# Altium schematic sheet Connectors.SchDoc
size A4
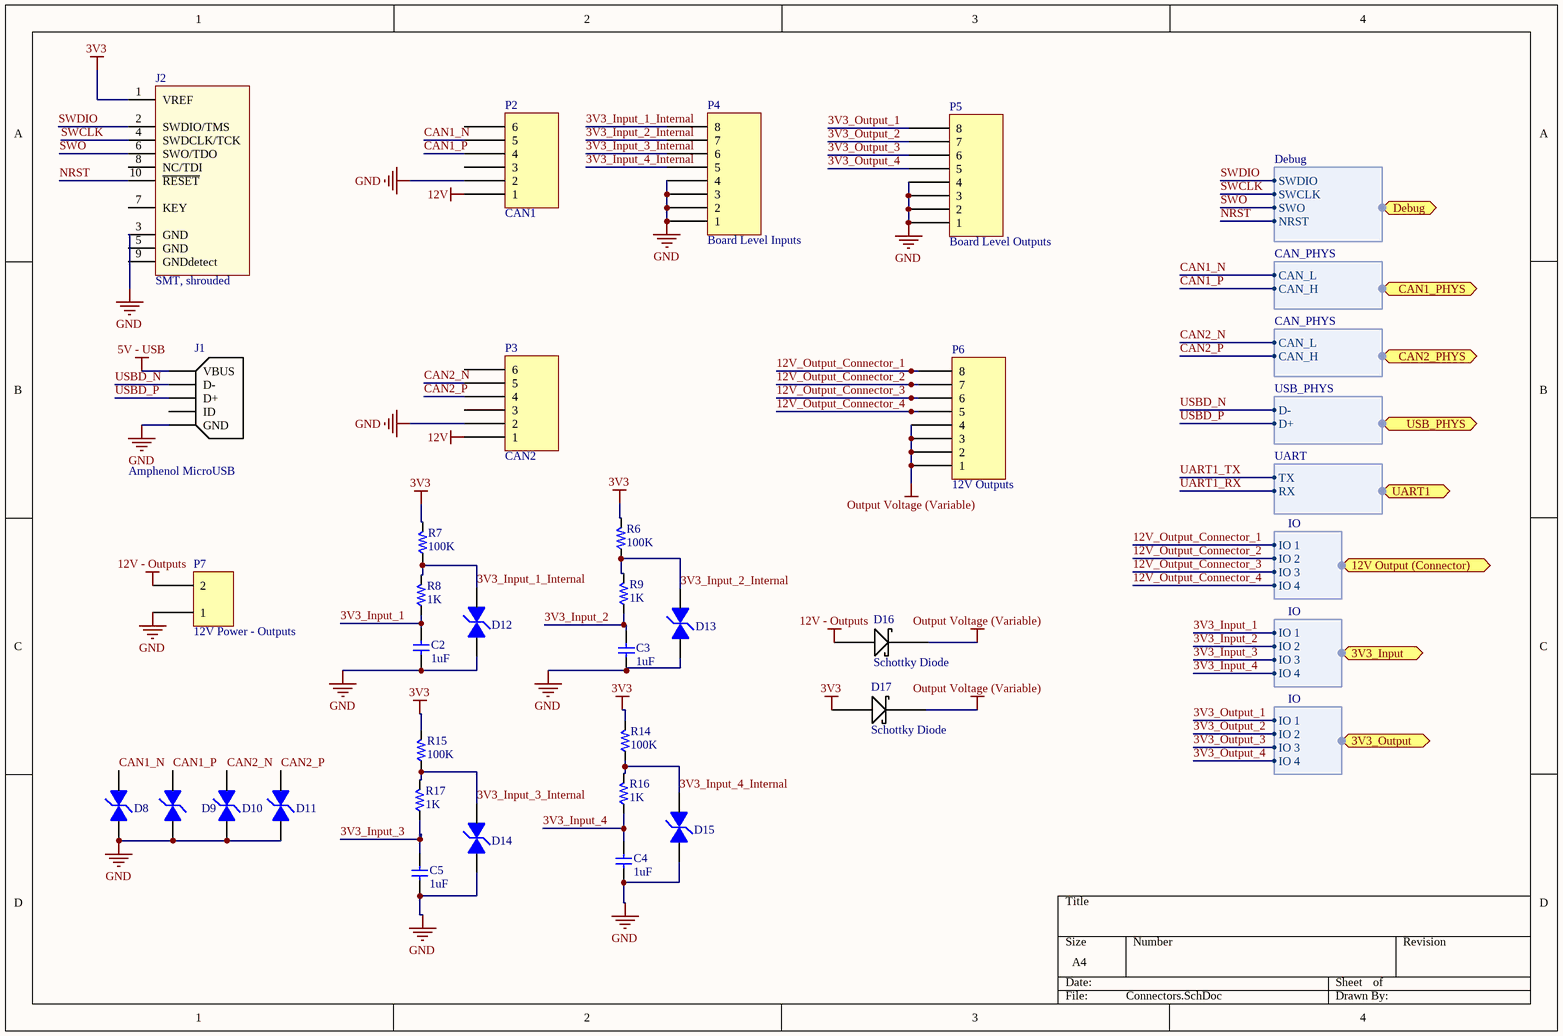
[diagram p0: Connectors.SchDoc]

## Parts
C2  value 1uF  [PCB_GENERIC_SMD_0603]  (hidden comment: C060-0001U-00)
C3  value 1uF  [PCB_GENERIC_SMD_0603]  (hidden comment: C060-0001U-00)
C4  value 1uF  [PCB_GENERIC_SMD_0603]  (hidden comment: C060-0001U-00)
C5  value 1uF  [PCB_GENERIC_SMD_0603]  (hidden comment: C060-0001U-00)
D8  TVS Diode  [TVS Diode]  (value not drawn)
D9  TVS Diode  [TVS Diode]  (value not drawn)
D10  TVS Diode  [TVS Diode]  (value not drawn)
D11  TVS Diode  [TVS Diode]  (value not drawn)
D12  TVS Diode  [TVS Diode]  (value not drawn)
D13  TVS Diode  [TVS Diode]  (value not drawn)
D14  TVS Diode  [TVS Diode]  (value not drawn)
D15  TVS Diode  [TVS Diode]  (value not drawn)
D16  Schottky Diode  [ON Semi Schottky Diode - MBRM110LT1G]
D17  Schottky Diode  [ON Semi Schottky Diode - MBRM110LT1G]
J1  Amphenol MicroUSB  [Amphenol MicroUSB]
J2  SMT, shrouded  [CONN-50mil-10POS-SMD]
P2  CAN1  [PCB_MLX_MICROFIT_3X2]
P3  CAN2  [PCB_MLX_MICROFIT_3X2]
P4  Board Level Inputs  [PCB_MLX_MICROFIT_4X2]
P5  Board Level Outputs  [PCB_MLX_MICROFIT_4X2]
P6  12V Outputs  [PCB_MLX_MICROFIT_4X2]
P7  12V Power - Outputs  [Molex Mini-Fit Jr 2x1]
R6  value 100K  [PCB_GENERIC_SMD_0603]  (hidden comment: R060-00104-05)
R7  value 100K  [PCB_GENERIC_SMD_0603]  (hidden comment: R060-00104-05)
R8  value 1K  [PCB_GENERIC_SMD_0603]  (hidden comment: R060-00102-05)
R9  value 1K  [PCB_GENERIC_SMD_0603]  (hidden comment: R060-00102-05)
R14  value 100K  [PCB_GENERIC_SMD_0603]  (hidden comment: R060-00104-05)
R15  value 100K  [PCB_GENERIC_SMD_0603]  (hidden comment: R060-00104-05)
R16  value 1K  [PCB_GENERIC_SMD_0603]  (hidden comment: R060-00102-05)
R17  value 1K  [PCB_GENERIC_SMD_0603]  (hidden comment: R060-00102-05)

## Ports
3V3_Input (harness IO), 3V3_Output (harness IO), 12V Output (Connector) (harness IO), CAN1_PHYS (harness CAN_PHYS), CAN2_PHYS (harness CAN_PHYS), Debug (harness Debug), UART1 (harness UART), USB_PHYS (harness USB_PHYS)

## Harnesses
Debug: SWDIO, SWCLK, SWO, NRST
CAN_PHYS: CAN_L, CAN_H
USB_PHYS: D-, D+
UART: TX, RX
IO: IO 1, IO 2, IO 3, IO 4

## Nets
3V3: D17.2 J2.1(VREF) R6.2 R7.2 R14.2 R15.2
5V - USB: J1.1(VBUS)
12V: P2.1 P3.1
12V - Outputs: D16.2 P7.2
GND: C2.1 C3.1 C4.1 C5.1 D8.2 D9.2 D10.2 D11.2 D12.2 D13.2 D14.2 D15.2 J1.5(GND) J2.3(GND) P2.2 P3.2 P4.1 P4.2 P4.3 P4.4 P5.1 P5.2 P5.3 P5.4 P7.1
Output Voltage (Variable): D16.1 D17.1 P6.1 P6.2 P6.3 P6.4
3V3_Input_1: C2.2 R8.1 ; port 3V3_Input.IO 1
3V3_Input_1_Internal: D12.1 P4.8 R7.1 R8.2
3V3_Input_2: C3.2 R9.1 ; port 3V3_Input.IO 2
3V3_Input_2_Internal: D13.1 P4.7 R6.1 R9.2
3V3_Input_3: C5.2 R17.1 ; port 3V3_Input.IO 3
3V3_Input_3_Internal: D14.1 P4.6 R15.1 R17.2
3V3_Input_4: C4.2 R16.1 ; port 3V3_Input.IO 4
3V3_Input_4_Internal: D15.1 P4.5 R14.1 R16.2
3V3_Output_1: P5.8 ; port 3V3_Output.IO 1
3V3_Output_2: P5.7 ; port 3V3_Output.IO 2
3V3_Output_3: P5.6 ; port 3V3_Output.IO 3
3V3_Output_4: P5.5 ; port 3V3_Output.IO 4
12V_Output_Connector_1: P6.8 ; port 12V Output (Connector).IO 1
12V_Output_Connector_2: P6.7 ; port 12V Output (Connector).IO 2
12V_Output_Connector_3: P6.6 ; port 12V Output (Connector).IO 3
12V_Output_Connector_4: P6.5 ; port 12V Output (Connector).IO 4
CAN1_N: D8.1 P2.5 ; port CAN1_PHYS.CAN_L
CAN1_P: D9.1 P2.4 ; port CAN1_PHYS.CAN_H
CAN2_N: D10.1 P3.5 ; port CAN2_PHYS.CAN_L
CAN2_P: D11.1 P3.4 ; port CAN2_PHYS.CAN_H
NRST: J2.10(~{RESET}) ; port Debug.NRST
SWCLK: J2.4(SWDCLK/TCK) ; port Debug.SWCLK
SWDIO: J2.2(SWDIO/TMS) ; port Debug.SWDIO
SWO: J2.6(SWO/TDO) ; port Debug.SWO
UART1_RX: port UART1.RX
UART1_TX: port UART1.TX
USBD_N: J1.2(D-) ; port USB_PHYS.D-
USBD_P: J1.3(D+) ; port USB_PHYS.D+

Not connected (* = marked no-connect by the designer): J1 4(ID); J2 5(GND) 7(KEY) 8(NC/TDI) 9(GNDdetect); P2 3 6; P3 3 6

## Library data of the parts
C2-C5 = C060-0001U-00: CAP CER 0603 1uF 16V X5R 20%; Tolerance: 20%; Voltage: 16V; Package: 0603
D8-D15 = TVS Diode: Manufacturer: Bourns; Manufacturer ID: CDSOD323-T03SC
D16 D17 = ON Semi Schottky Diode - MBRM110LT1G
J1 = Amphenol MicroUSB - 609-4618-1-ND
J2 = conn_0.050"_cortexM: ARM Cortex-M 10pin connector,shrouded,SMT; Supplier 1: Digi-Key; Supplier Part Number 1: 1175-1629-ND
P2 P3 = SCH_MLX_MICROFIT_3X2
P4-P6 = SCH_MLX_MICROFIT_4X2: Molex Microfit Connector 4x2
P7 = Molex Mini-Fit 1x2
R6 R7 R14 R15 = R060-00104-05: RES 0603 100K 5% 63mW; Tolerance: 5%; Power: 63mW; Package: 0603
R8 R9 R16 R17 = R060-00102-05: RES 0603 1K 5% 63mW; Tolerance: 5%; Power: 63mW; Package: 0603